# EAGLE design TeensyLED 15061000 (EAGLE 7.2.0)
DESCRIPTION: SaikoLED TeensyLED Breakout Board; DOCUMENT_NUMBER: 15041400; DRAWING_TITLE: TeensyLED; INFO: Brian Neltner, SaikoLED LLC, neltnerb@saikoled.com; REV: 15061000; VER: X3

## Sheet 1 of 4
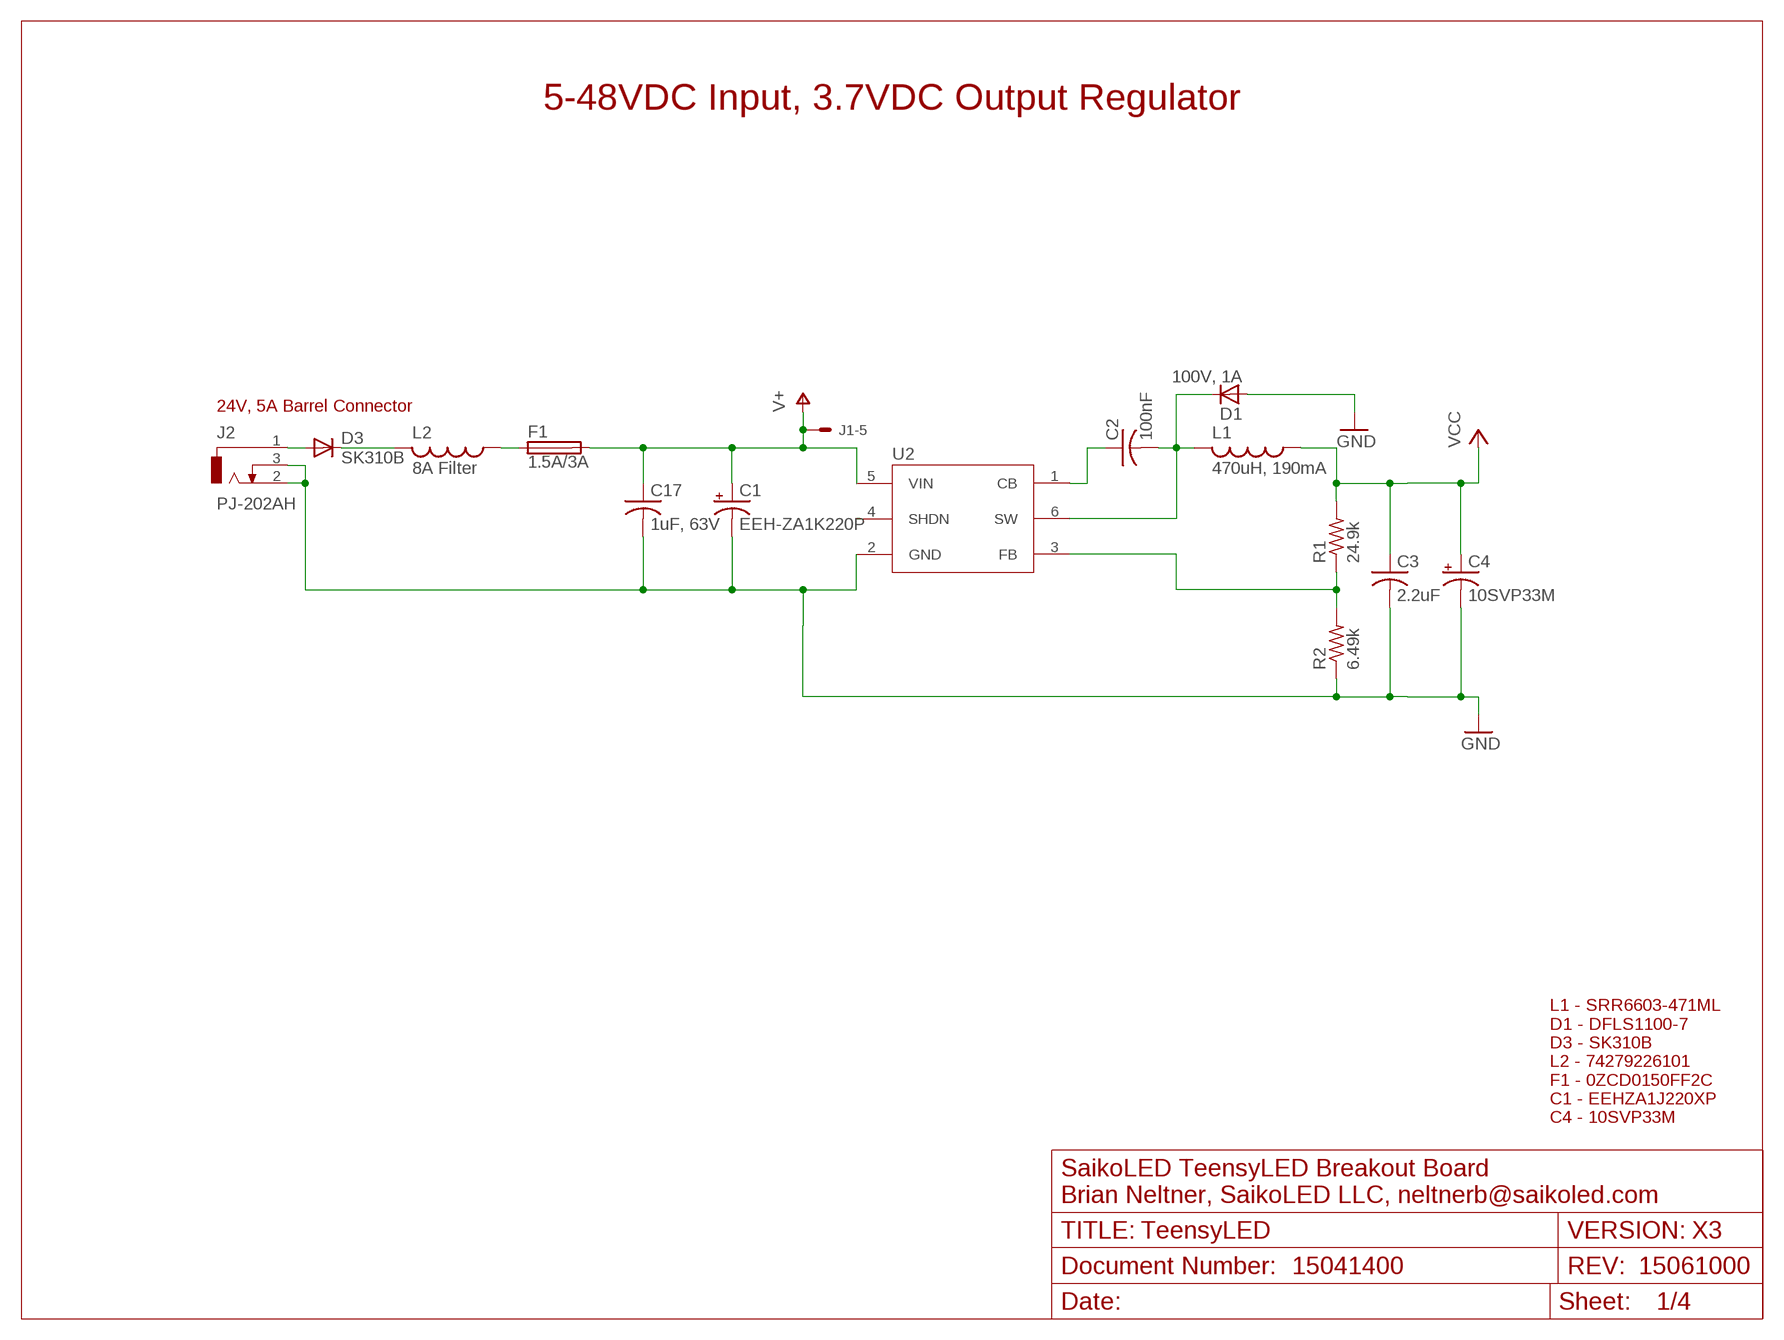
[diagram p0: schematic, sheet 1]

### Parts
C1  EEH-ZA1K220P  CPOL-USF  [PANASONIC_F]
C2  100nF  C-USC0805K  [C0805K]
C3  2.2uF  C-USC0402PRO  [C0402PRO]
C4  10SVP33M  CPOL-USB  [PANASONIC_B]
C17  1uF, 63V  C-USC0805K  [C0805K]
D1  100V, 1A  DFLS1100  [DFLS1100]
D3  SK310B  DIODE-SMB  [SMB]
F1  1.5A/3A  PTCFUSE-0ZCD  [2920]
FRAME1  LETTER_LNOSILK  [EMPTY]
J1  22-05-7058-05  [7395-05]
J2  PJ-202AH  [PJ-202AH]
L1  470uH, 190mA  L-US-SRR6603  [SRR6603]
L2  8A Filter  L-USL1812  [L1812]
R1  24.9k  R-US_R0402PRO  [R0402PRO]
R2  6.49k  R-US_R0402PRO  [R0402PRO]
U2  LMR16006YDDCT  [DDC0006A]

### Nets
GND: C1.- C3.2 C4.- C17.2 D1.A J2.2 J2.3 R2.1 U2.2(GND) ; also sheet 2,3,4
N$2: C2.1 U2.1(CB)
N$4: F1.P$1 L2.1
N$5: R1.1 R2.2 U2.3(FB)
N$9: D3.C L2.2
N$30: D3.A J2.1
V+: C1.+ C17.1 F1.P$2 J1.5 U2.5(VIN) ; also sheet 2
VCC: C3.1 C4.+ L1.P$1 R1.2 ; also sheet 3
VSW: C2.2 D1.C L1.P$2 U2.6(SW)
Unconnected: U2.4(SHDN)

### Notes on the sheet
- 5-48VDC Input, 3.7VDC Output Regulator
- 24V, 5A Barrel Connector
- L1 - SRR6603-471ML
  D1 - DFLS1100-7
  D3 - SK310B
  L2 - 74279226101
  F1 - 0ZCD0150FF2C
  C1 - EEHZA1J220XP
  C4 - 10SVP33M

## Sheet 2 of 4
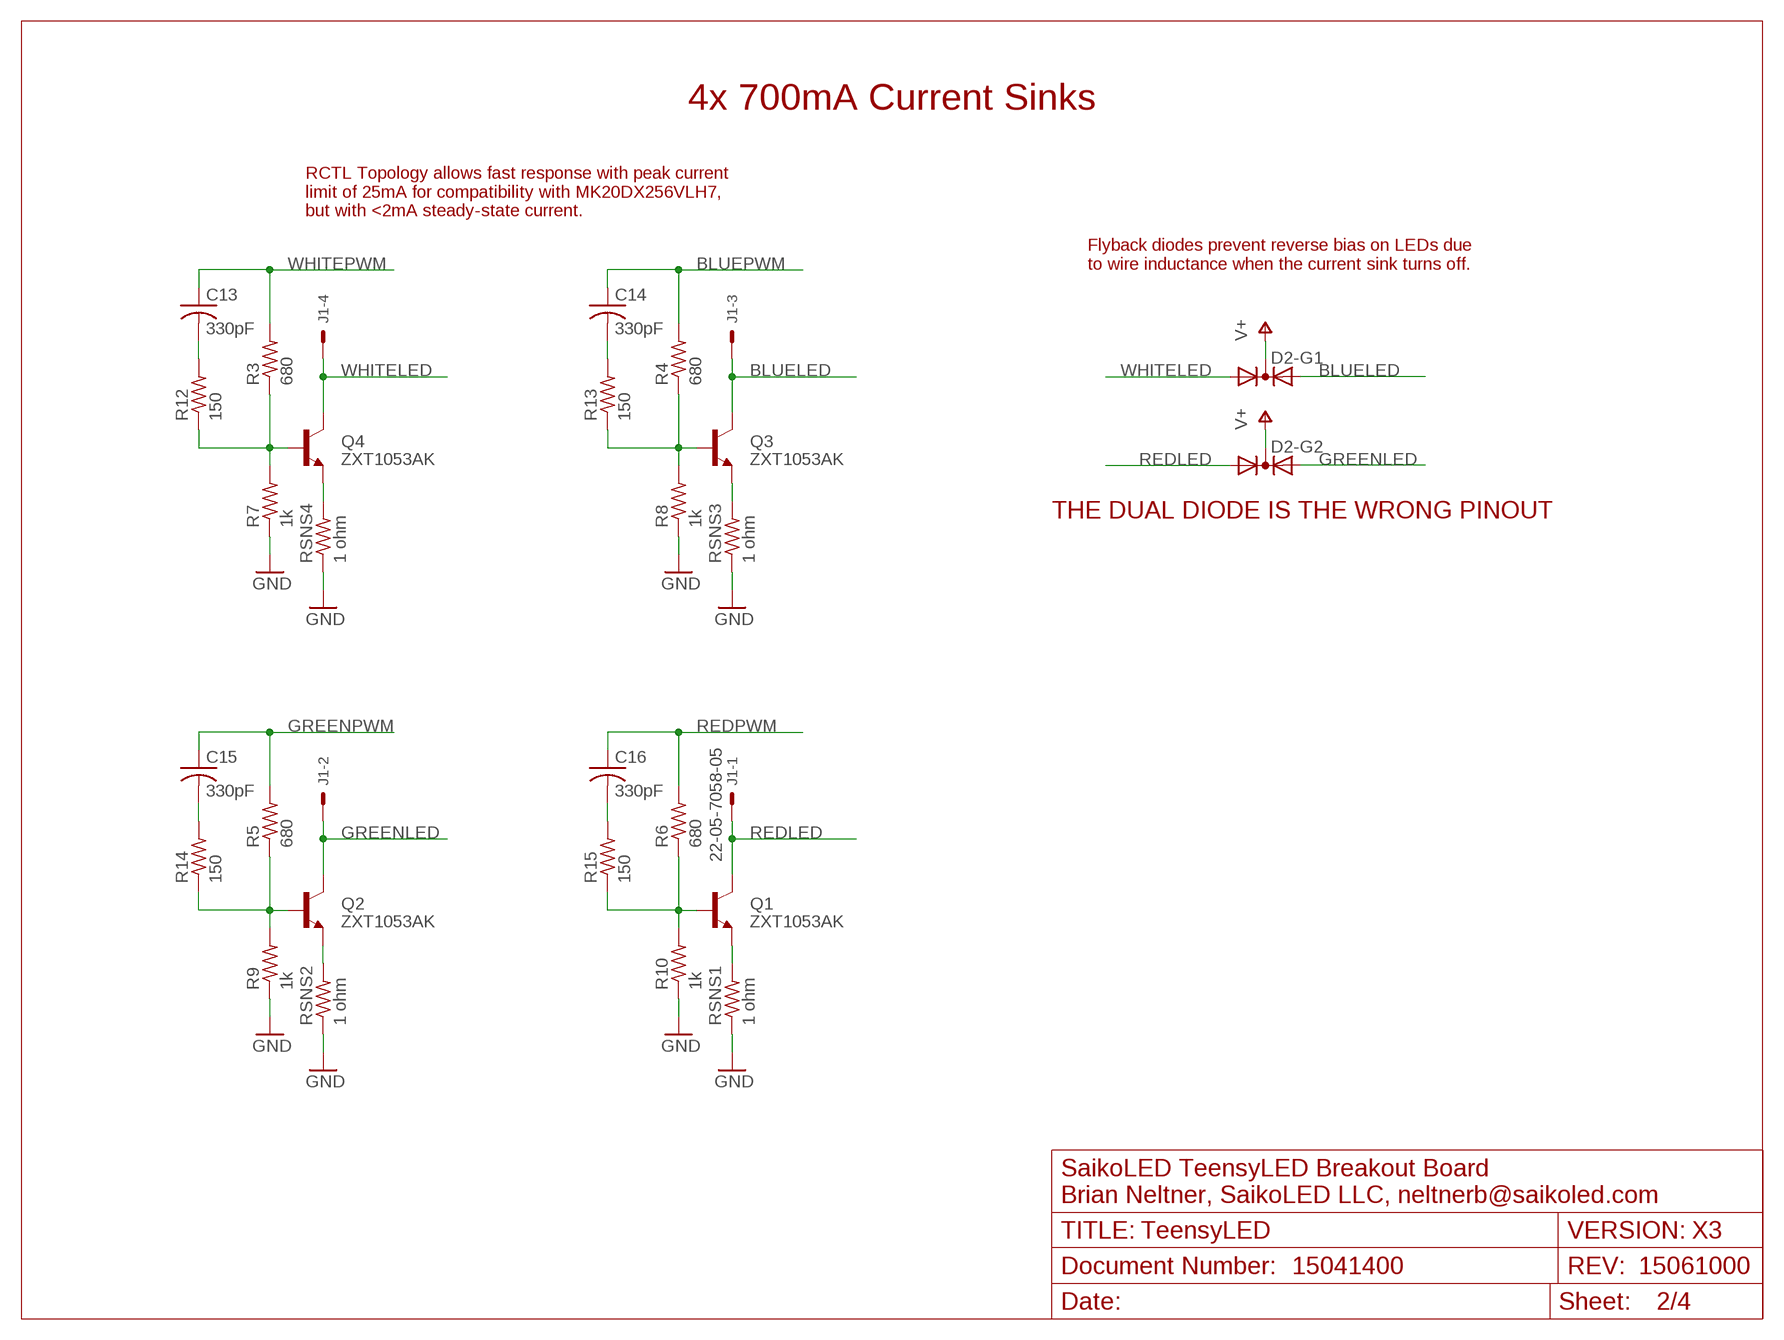
[diagram p1: schematic, sheet 2]

### Parts
C13  330pF  C-USC0402PRO  [C0402PRO]
C14  330pF  C-USC0402PRO  [C0402PRO]
C15  330pF  C-USC0402PRO  [C0402PRO]
C16  330pF  C-USC0402PRO  [C0402PRO]
D2  DUAL_DIODE_AC-CA-SOT363  [SOT363_PHILIPS]
FRAME2  LETTER_LNOSILK  [EMPTY]
Q1  ZXT1053AK  [TO252]
Q2  ZXT1053AK  [TO252]
Q3  ZXT1053AK  [TO252]
Q4  ZXT1053AK  [TO252]
R3  680  R-US_R0402PRO  [R0402PRO]
R4  680  R-US_R0402PRO  [R0402PRO]
R5  680  R-US_R0402PRO  [R0402PRO]
R6  680  R-US_R0402PRO  [R0402PRO]
R7  1k  R-US_R0402PRO  [R0402PRO]
R8  1k  R-US_R0402PRO  [R0402PRO]
R9  1k  R-US_R0402PRO  [R0402PRO]
R10  1k  R-US_R0402PRO  [R0402PRO]
R12  150  R-US_R0402PRO  [R0402PRO]
R13  150  R-US_R0402PRO  [R0402PRO]
R14  150  R-US_R0402PRO  [R0402PRO]
R15  150  R-US_R0402PRO  [R0402PRO]
RSNS1  1 ohm  R-US_R1206  [R1206]
RSNS2  1 ohm  R-US_R1206  [R1206]
RSNS3  1 ohm  R-US_R1206  [R1206]
RSNS4  1 ohm  R-US_R1206  [R1206]

### Nets
BLUELED: D2.3(-G1:A2) J1.3 Q3.C
BLUEPWM: C14.1 R4.2 ; also sheet 3
GND: R7.1 R8.1 R9.1 R10.1 RSNS1.1 RSNS2.1 RSNS3.1 RSNS4.1 ; also sheet 1,3,4
GREENLED: D2.4(-G2:A2) J1.2 Q2.C
GREENPWM: C15.1 R5.2 ; also sheet 3
N$8: Q2.E RSNS2.2
N$11: Q4.E RSNS4.2
N$12: Q3.E RSNS3.2
N$15: Q1.E RSNS1.2
N$16: Q2.B R5.1 R9.2 R14.1
N$20: Q4.B R3.1 R7.2 R12.1
N$22: Q1.B R6.1 R10.2 R15.1
N$26: C13.2 R12.2
N$27: C14.2 R13.2
N$28: C15.2 R14.2
N$29: C16.2 R15.2
R23: Q3.B R4.1 R8.2 R13.1
REDLED: D2.6(-G2:A1) J1.1 Q1.C
REDPWM: C16.1 R6.2 ; also sheet 3
V+: D2.2(-G1:K) D2.5(-G2:K) ; also sheet 1
WHITELED: D2.1(-G1:A1) J1.4 Q4.C
WHITEPWM: C13.1 R3.2 ; also sheet 3

### Notes on the sheet
- 4x 700mA Current Sinks
- RCTL Topology allows fast response with peak current
  limit of 25mA for compatibility with MK20DX256VLH7,
  but with <2mA steady-state current.
- Flyback diodes prevent reverse bias on LEDs due
  to wire inductance when the current sink turns off.
- THE DUAL DIODE IS THE WRONG PINOUT

## Sheet 3 of 4
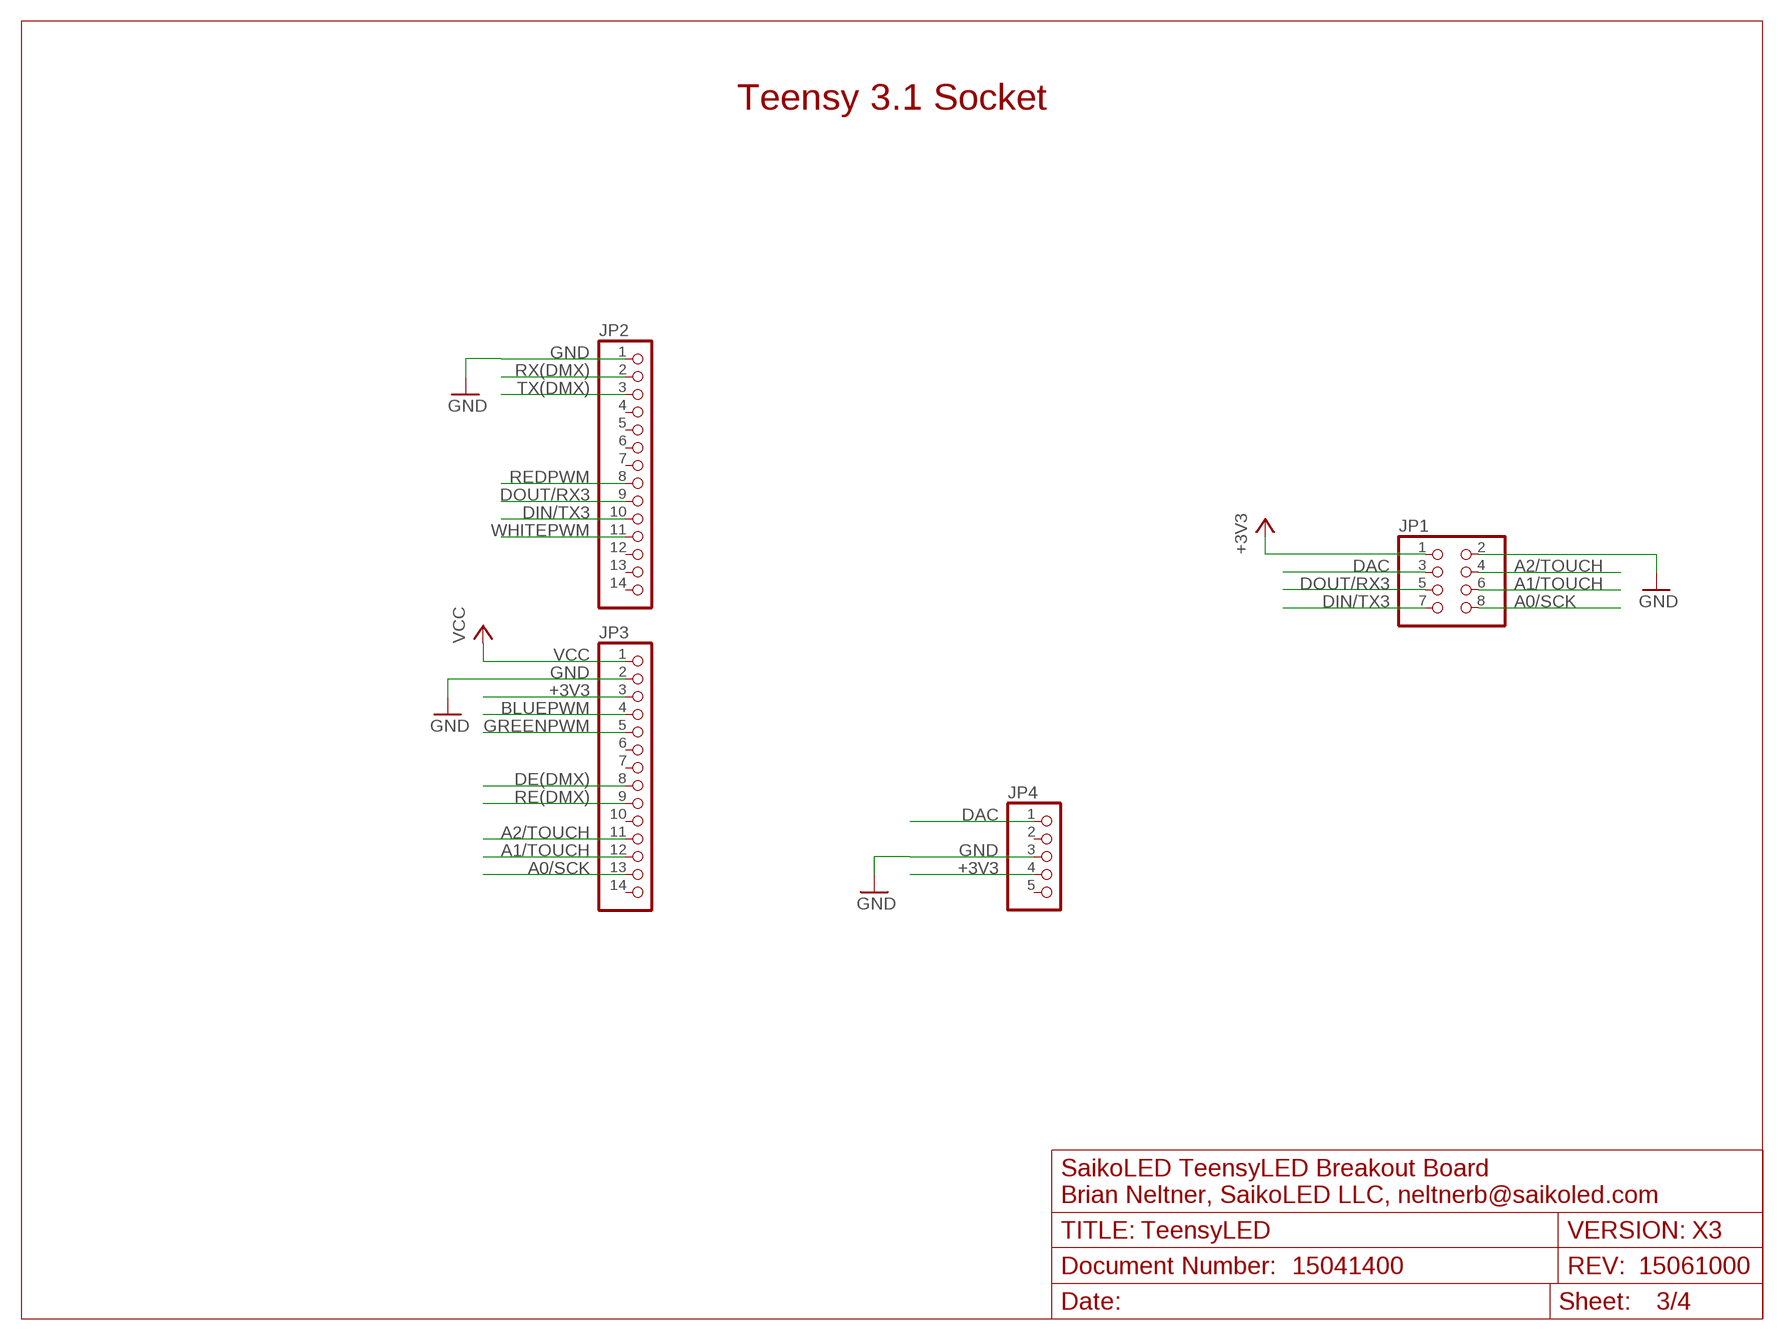
[diagram p2: schematic, sheet 3]

### Parts
FRAME3  LETTER_LNOSILK  [EMPTY]
JP1  PINHD-2X4  [2X04]
JP2  PINHD-1X14/ROUND  [1X14/ROUND]
JP3  PINHD-1X14/ROUND  [1X14/ROUND]
JP4  PINHD-1X5/ROUND  [1X05/ROUND]

### Nets
+3V3: JP1.1 JP3.3 JP4.4 ; also sheet 4
A0/SCK: JP1.8 JP3.13
A1/TOUCH: JP1.6 JP3.12
A2/TOUCH: JP1.4 JP3.11
BLUEPWM: JP3.4 ; also sheet 2
DAC: JP1.3 JP4.1
DE(DMX): JP3.8 ; also sheet 4
DIN/TX3: JP1.7 JP2.10
DOUT/RX3: JP1.5 JP2.9
GND: JP1.2 JP2.1 JP3.2 JP4.3 ; also sheet 1,2,4
GREENPWM: JP3.5 ; also sheet 2
RE(DMX): JP3.9 ; also sheet 4
REDPWM: JP2.8 ; also sheet 2
RX(DMX): JP2.2 ; also sheet 4
TX(DMX): JP2.3 ; also sheet 4
VCC: JP3.1 ; also sheet 1
WHITEPWM: JP2.11 ; also sheet 2
Unconnected: JP2.4 JP2.5 JP2.6 JP2.7 JP2.12 JP2.13 JP2.14 JP3.6 JP3.7 JP3.10 JP3.14 JP4.2 JP4.5

### Notes on the sheet
- Teensy 3.1 Socket

## Sheet 4 of 4
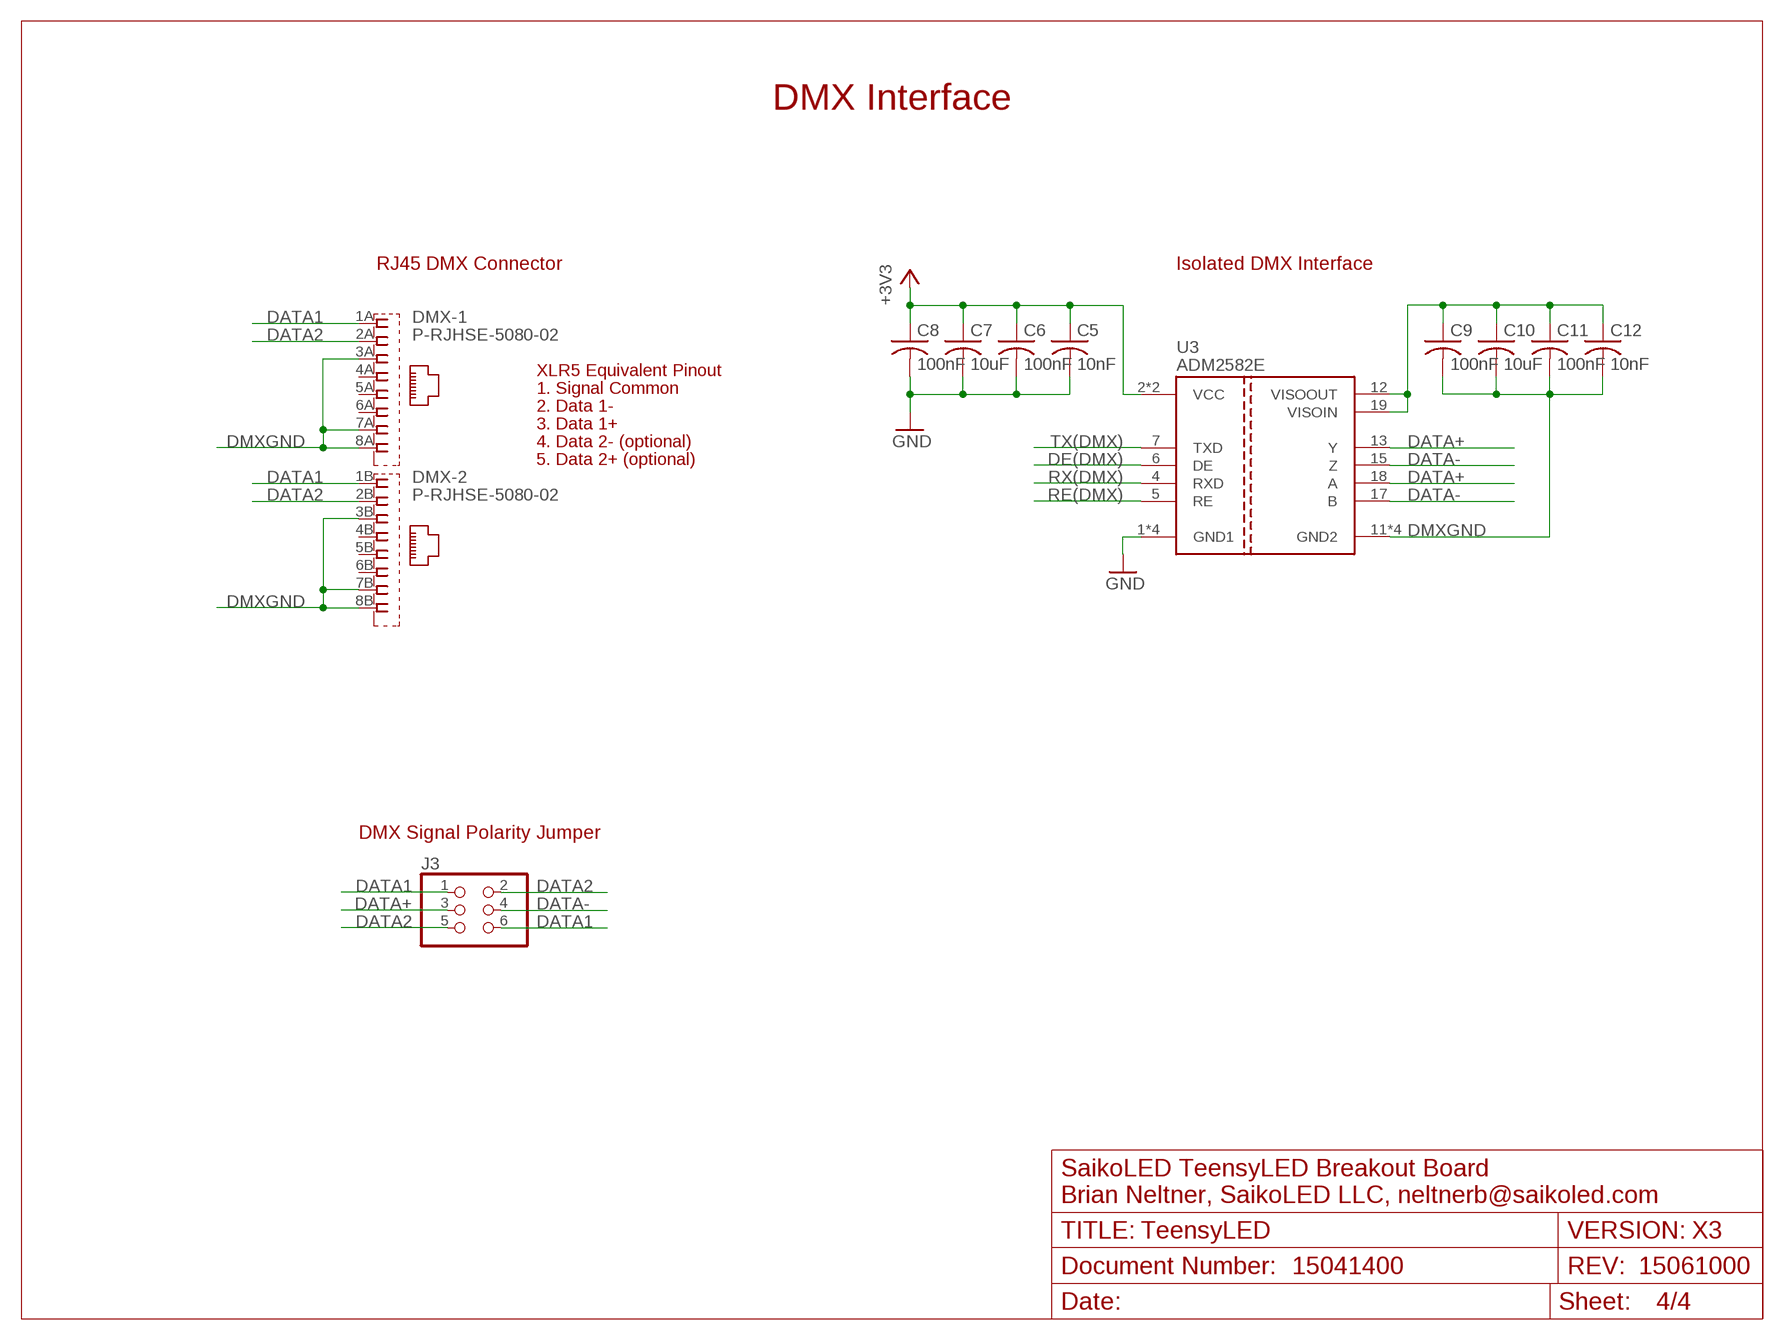
[diagram p3: schematic, sheet 4]

### Parts
C5  10nF  C-USC0402PRO  [C0402PRO]
C6  100nF  C-USC0402PRO  [C0402PRO]
C7  10uF  C-USC0402PRO  [C0402PRO]
C8  100nF  C-USC0402PRO  [C0402PRO]
C9  100nF  C-USC0402PRO  [C0402PRO]
C10  10uF  C-USC0402PRO  [C0402PRO]
C11  100nF  C-USC0402PRO  [C0402PRO]
C12  10nF  C-USC0402PRO  [C0402PRO]
DMX  P-RJHSE-5080-02  [P-RJHSE-5080-02]
FRAME4  LETTER_LNOSILK  [EMPTY]
J3  PINHD-2X3  [2X03]
U3  ADM2582E  [SO-20DW]

### Nets
+3V3: C5.1 C6.1 C7.1 C8.1 U3.2(VCC) U3.8(VCC) ; also sheet 3
DATA1: DMX.1A DMX.1B J3.1 J3.6
DATA2: DMX.2A DMX.2B J3.2 J3.5
DATA+: J3.3 U3.13(Y) U3.18(A)
DATA-: J3.4 U3.15(Z) U3.17(B)
DE(DMX): U3.6(DE) ; also sheet 3
DMXGND: C9.2 C10.2 C11.2 C12.2 DMX.3A DMX.3B DMX.7A DMX.7B DMX.8A DMX.8B U3.11(GND2) U3.14(GND2) U3.16(GND2) U3.20(GND2)
GND: C5.2 C6.2 C7.2 C8.2 U3.1(GND1) U3.3(GND1) U3.9(GND1) U3.10(GND1) ; also sheet 1,2,3
N$10: C9.1 C10.1 C11.1 C12.1 U3.12(VISOOUT) U3.19(VISOIN)
RE(DMX): U3.5(RE) ; also sheet 3
RX(DMX): U3.4(RXD) ; also sheet 3
TX(DMX): U3.7(TXD) ; also sheet 3
Unconnected: DMX.4A DMX.4B DMX.5A DMX.5B DMX.6A DMX.6B

### Notes on the sheet
- DMX Interface
- RJ45 DMX Connector | Isolated DMX Interface
- XLR5 Equivalent Pinout
- 1. Signal Common
- 2. Data 1-
- 3. Data 1+
- 4. Data 2- (optional)
- 5. Data 2+ (optional)
- DMX Signal Polarity Jumper

## Library data of the parts
C1 C4 = rcl:CPOL-US: POLARIZED CAPACITOR, American symbol
C2 = rcl:C-US: CAPACITOR, American symbol; OC_NEWARK: unknown
C3 C17 = rcl:C-US: CAPACITOR, American symbol; MF: Multicomp Passives; MPN: MCLV4R7M1HB-0513-RH; OC_NEWARK: 79K3674
C5-C16 = rcl:C-US: CAPACITOR, American symbol
D1 = 0_diodes:DFLS1100: Reference DIODE temperature compensated, 6,2 V
D2 = 0_diodes:DUAL_DIODE_AC-CA: DUAL DIODE
D3 = diode:DIODE-: DIODE
DMX = 0_amphenol:P-RJHSE-5080-02: Mod. Jack, Right Angle, 8 posiotion, 8 contatcs RJ45 Source: GLX-S-88M.pdf
F1 = 0_bel_fuse:PTCFUSE: LITTLEFUSE Picofuse/slow Littlefuse
FRAME1-FRAME4 = frames:LETTER_L: FRAME LETTER landscape
J1 = con-molex:22-?-05: CONNECTOR wire to board 2.54 mm (.1 inch) pitch header; OC_FARNELL: unknown; OC_NEWARK: unknown
J2 = 0_cui:PJ-202AH: DC POWER JACK Source: DCJ0202.pdf
J3 = pinhead:PINHD-2X3: PIN HEADER
JP1 = pinhead:PINHD-2X4: PIN HEADER
JP2 JP3 = pinhead:PINHD-1X14: PIN HEADER
JP4 = pinhead:PINHD-1X5: PIN HEADER
L1 = 0_coilcraft:L-US: INDUCTOR, American symbol
L2 = rcl:L-US: INDUCTOR, American symbol
Q1-Q4 = 0_diodes:ZXT1053AK: NPN Transistor ZXT1053AK DPAK TRANSISTOR 5A, 75V, hFE=300@1A, 4.4W
R1 = rcl:R-US_: RESISTOR, American symbol; MPN: BLU0402-9762-BT25W; OC_NEWARK: 32Y2244
R2 = rcl:R-US_: RESISTOR, American symbol; MPN: ERJ-3EKF4123V; OC_NEWARK: 53W4620
R3-R10 R12-R15 RSNS1-RSNS4 = rcl:R-US_: RESISTOR, American symbol
U2 = 0_texas_instruments:LMR16006YDDCT; COMPTYPE: IC; MANUFACTURER: Texas Instruments; MANUFACTURER_NAME: Texas Instruments; MANUFACTURER_PART_NUMBER: LMR16006YDDCT; MF: FARNELL; MOUNTTYPE: SMT; MPN: MCF 0.25W 1K; OC_NEWARK: 38K0327; PACKAGEREFERENCE: DDC0006A; PARTNUMBER: LMR16006YDDC; PIN_COUNT: 6; REFDES: RefDes; ROHS: Y; TYPE: TYPE; VALUE: Value
U3 = 0_analog_devices:ADM2582E

## Board
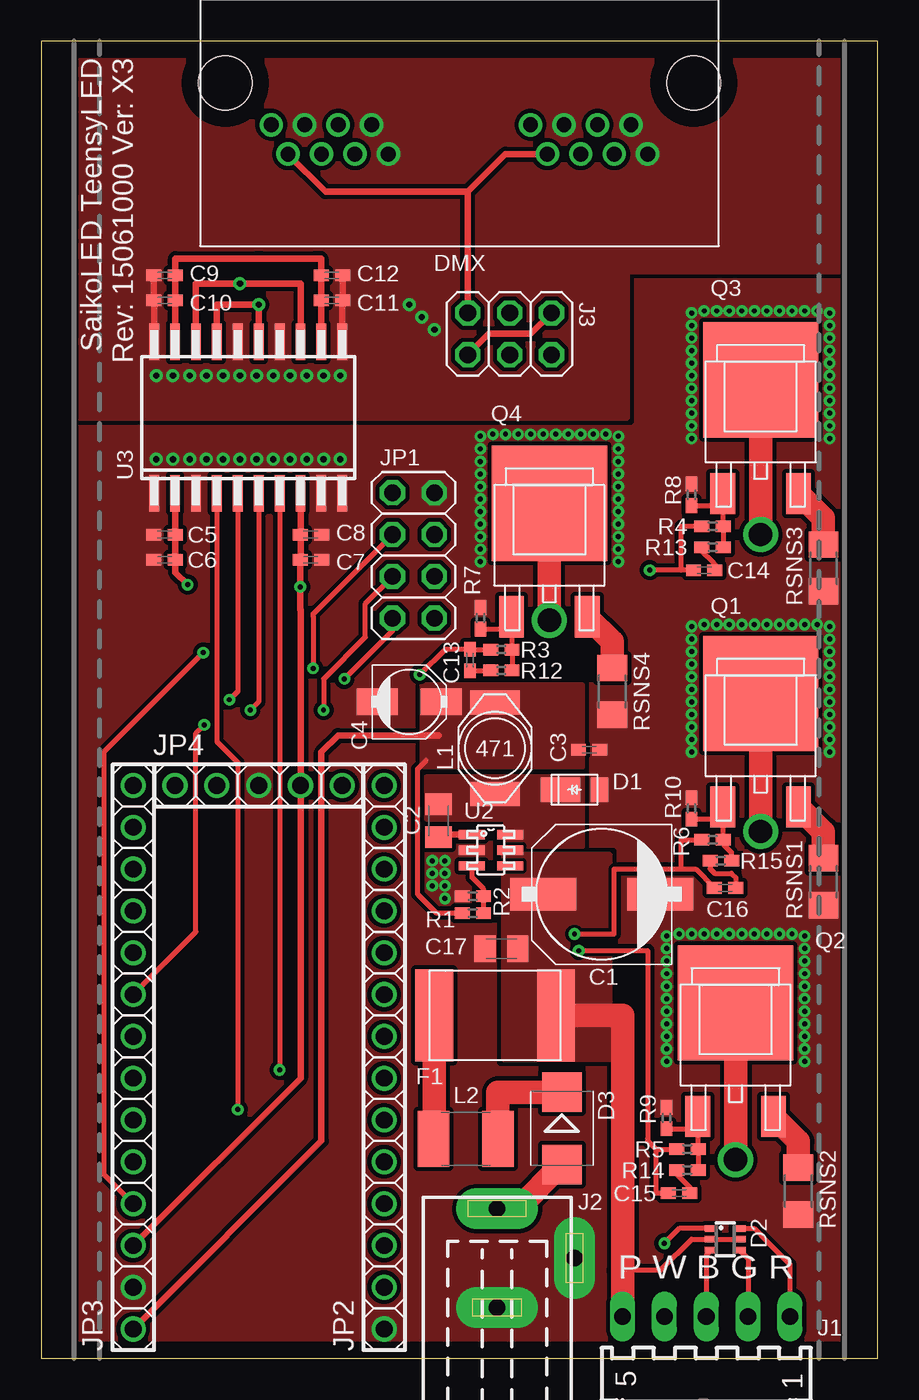
[diagram p4: board, top side]
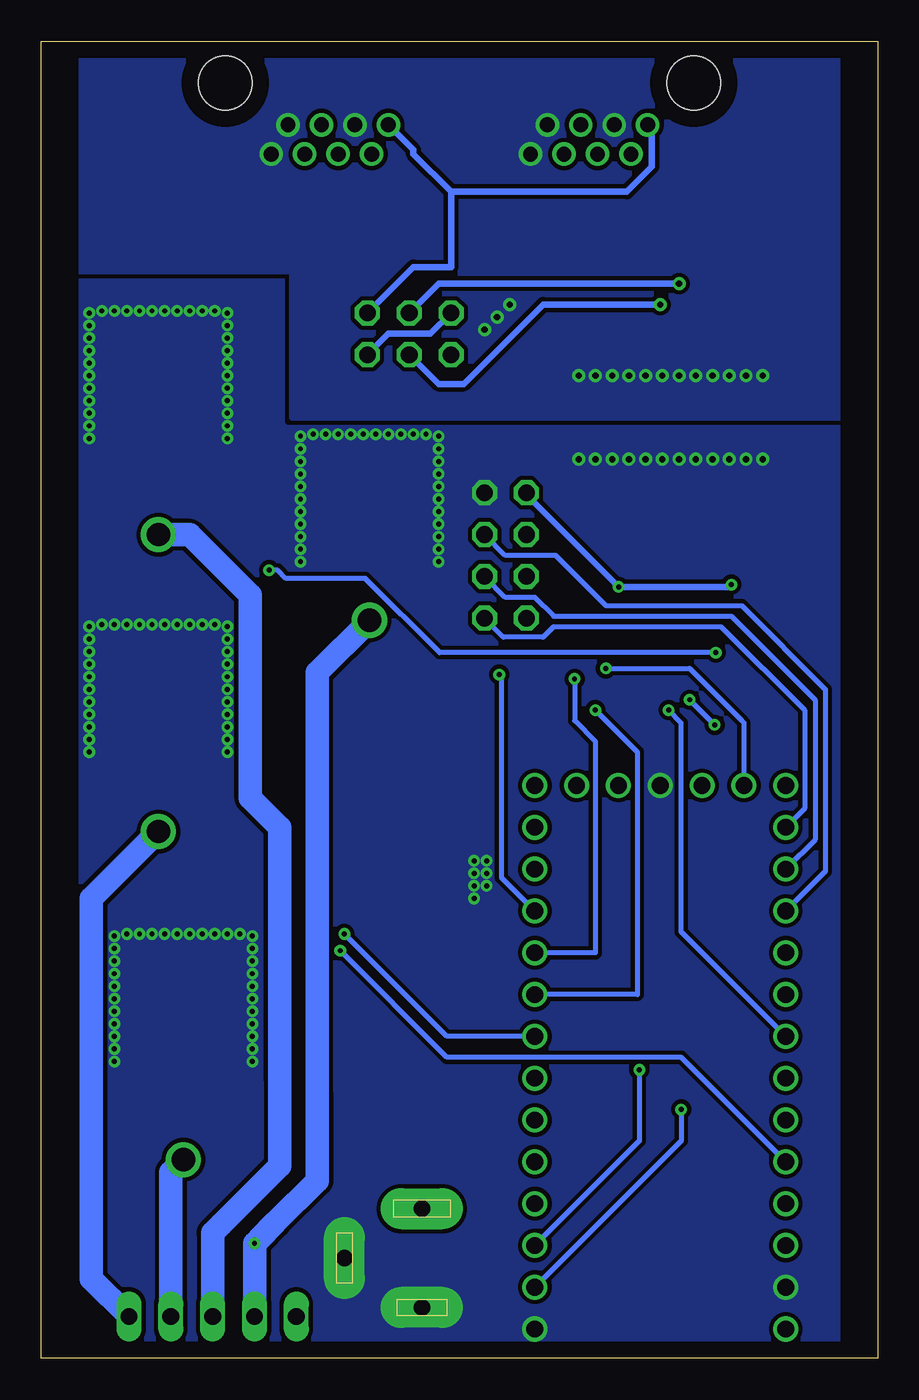
[diagram p5: board, bottom side, seen from below]

Size 50.8 x 80.01 mm. Coordinates in mm from the lower left corner, seen from the top.
Outline: 0,0 50.8,0 50.8,80.01 0,80.01 0,0
Copper layers (1*16): Top 0.035mm / dielectric 1.5mm / Bottom 0.035mm
Design rules "default *": minimum track width 12mil, minimum drill 0.3mm, track to track 8mil, track to pad 8mil, pad to pad 8mil, via to via 8mil, smd to smd 8mil, copper to edge 40mil, drill to drill 8mil, minimum pad ring 10mil, minimum via ring 8mil, stop-mask expansion 4mil, vias tented up to drill 0mil, thermal gap 10mil
tRestrict: area 0,0 to 2,80; area 48.8,0 to 50.8,80
bRestrict: area 0,0 to 2,80; area 48.8,0 to 50.8,80

### Footprints (pad centres in the part's own frame; a part is rotated, then mirrored left to right if it is on the bottom)
PANASONIC_F = smd 4 x 2: + 3.55,0; - -3.55,0
C0805K = smd 1.3 x 1.6: 1 -1,0; 2 1,0
C0402PRO = smd 0.9 x 0.7: 1 -0.65,0; 2 0.65,0
PANASONIC_B = smd 2.5 x 1.6: + 1.95,0; - -1.95,0
DFLS1100 = smd 1.05 x 1.5: A -1.525,0 | smd 2.4 x 1.5: C 0.85,0
SOT363_PHILIPS = smd 0.4 x 0.8: 1 -0.65,-0.85; 2 0,-0.85; 3 0.65,-0.85; 4 0.65,0.85; 5 0,0.85; 6 -0.65,0.85
SMB = smd 2.4 x 2.4: A 2.2,0; C -2.2,0
P-RJHSE-5080-02 = drill 0.9 pad 1.422: 1A 11.43,2.54; 1B -4.318,2.54; 2A 10.414,4.318; 2B -5.334,4.318; 3A 9.398,2.54; 3B -6.35,2.54; 4A 8.382,4.318; 4B -7.366,4.318; 5A 7.366,2.54; 5B -8.382,2.54; 6A 6.35,4.318; 6B -9.398,4.318; 7A 5.334,2.54; 7B -10.414,2.54; 8A 4.318,4.318; 8B -11.43,4.318 | hole 3.251: -14.224,0; 14.224,0
2920 = smd 2.3 x 5.6: P$1 -3.7,0; P$2 3.7,0
7395-05 = drill 1.016 long: 1 5.08,0; 2 2.54,0; 3 0,0; 4 -2.54,0; 5 -5.08,0
PJ-202AH = drill 1 pad 2.5 long: 1 0,3; 2 0,-3; 3 4.7,0
2X03 = drill 1.016 octagon: 1 -2.54,-1.27; 2 -2.54,1.27; 3 0,-1.27; 4 0,1.27; 5 2.54,-1.27; 6 2.54,1.27
2X04 = drill 1.016 octagon: 1 -3.81,-1.27; 2 -3.81,1.27; 3 -1.27,-1.27; 4 -1.27,1.27; 5 1.27,-1.27; 6 1.27,1.27; 7 3.81,-1.27; 8 3.81,1.27
1X14/ROUND = drill 1.016: 1 -16.51,0; 2 -13.97,0; 3 -11.43,0; 4 -8.89,0; 5 -6.35,0; 6 -3.81,0; 7 -1.27,0; 8 1.27,0; 9 3.81,0; 10 6.35,0; 11 8.89,0; 12 11.43,0; 13 13.97,0; 14 16.51,0
1X05/ROUND = drill 1.016: 1 -5.08,0; 2 -2.54,0; 3 0,0; 4 2.54,0; 5 5.08,0
SRR6603 = smd 1.45 x 3: P$1 -2.775,0; P$2 2.775,0
L1812 = smd 1.9 x 3.4: 1 -1.95,0; 2 1.95,0
TO252 = smd 1.5 x 2.5: B -2.3,-6.9; E 2.3,-6.9 | smd 7 x 7: C 0,0
R0402PRO = smd 0.9 x 0.7: 1 -0.65,0; 2 0.65,0
R1206 = smd 1.6 x 1.803: 1 -1.422,0; 2 1.422,0
DDC0006A = smd 1.575 x 0.559: 1 -1.168,0.95; 2 -1.168,0; 3 -1.168,-0.95; 4 1.168,-0.95; 5 1.168,0; 6 1.168,0.95
SO-20DW = smd 0.6 x 2.2: 1 -5.715,-4.6; 2 -4.445,-4.6; 3 -3.175,-4.6; 4 -1.905,-4.6; 5 -0.635,-4.6; 6 0.635,-4.6; 7 1.905,-4.6; 8 3.175,-4.6; 9 4.445,-4.6; 10 5.715,-4.6; 11 5.715,4.6; 12 4.445,4.6; 13 3.175,4.6; 14 1.905,4.6; 15 0.635,4.6; 16 -0.635,4.6; 17 -1.905,4.6; 18 -3.175,4.6; 19 -4.445,4.6; 20 -5.715,4.6

### Placement (x,y rotation side)
C1  34.04,28.19 180 top
C2  24.13,32.66 90 top
C3  33.27,36.96 0 top
C4  22.35,39.88 0 top
C5  7.49,50.04 180 top
C6  7.49,48.51 180 top
C7  16.38,48.51 0 top
C8  16.38,50.04 0 top
C9  7.49,65.79 180 top
C10  7.49,64.26 180 top
C11  17.65,64.26 0 top
C12  17.65,65.79 0 top
C13  26.04,42.42 270 top
C14  40.26,47.88 0 top
C15  38.73,10.03 0 top
C16  41.53,28.57 0 top
C17  27.94,24.89 180 top
D1  32.38,34.54 180 top
D2  41.53,7.24 270 top
D3  31.62,13.97 270 top
DMX  25.4,77.47 180 top
F1  27.56,20.83 0 top
FRAME1  0,0 0 top
FRAME2  0,0 0 top
FRAME3  0,0 0 top
FRAME4  0,0 0 top
J1  40.39,2.54 0 top
J2  27.69,6.1 0 top
J3  28.45,62.23 180 top
JP1  22.61,48.77 270 top
JP2  20.83,18.29 90 top
JP3  5.59,18.29 90 top
JP4  13.21,34.8 0 top
L1  27.56,37.06 270 top
L2  25.78,13.34 0 top
Q1  43.69,40.39 0 top
Q2  42.16,21.59 0 top
Q3  43.69,59.44 0 top
Q4  30.86,51.94 0 top
R1  26.21,27.05 180 top
R2  26.21,28.07 0 top
R3  27.94,43.05 180 top
R4  40.77,50.55 180 top
R5  39.24,12.7 180 top
R6  40.77,31.5 180 top
R7  26.67,44.96 270 top
R8  39.5,52.45 270 top
R9  37.97,14.61 270 top
R10  39.5,33.4 270 top
R12  27.94,41.78 180 top
R13  40.77,49.28 180 top
R14  39.24,11.43 180 top
R15  41.27,30.23 180 top
RSNS1  47.5,28.96 90 top
RSNS2  45.97,10.16 90 top
RSNS3  47.5,48.01 90 top
RSNS4  34.67,40.51 90 top
U2  27.3,30.86 0 top
U3  12.57,57.15 0 top

### Tracks (layer width: path | path; a pad name or v marks a point on that pad's centre or on a via)
+3V3  (via drill 0.3)
  Top 0.305: 8.13,48.58 C6.1 | 8.13,49.85 C5.1 8.13,50.16 | 8.13,52.39 U3.2 | 15.75,48.58 C7.1 | 15.75,49.85 C8.1 15.75,50.16 | 15.75,52.39 U3.8
  Top 0.406: 8.13,49.85 8.13,48.58 | 8.13,52.39 8.13,50.16 | 15.75,49.85 15.75,48.58 | 15.75,52.39 15.75,50.16 | C7.1 15.73,47.24 15.73,46.99 v15.73,46.86 15.73,45.48 15.75,45.47 JP4.4 15.75,17.02 JP3.3 | C5.1 8.14,47.74 v8.89,46.99
  Bottom 0.406: v8.89,46.99 9.02,46.86 v15.73,46.86 21.34,52.47 JP1.1
A0/SCK
  Bottom 0.305: JP1.8 22.73,43.81 20.32,43.81 19.68,44.45 9.53,44.45 4.45,39.37 4.45,33.4 JP3.13
A1/TOUCH
  Bottom 0.305: JP1.6 22.61,46.23 20.83,46.23 19.68,45.09 8.89,45.09 3.81,40.01 3.81,31.5 JP3.12
A2/TOUCH
  Bottom 0.305: JP1.4 22.61,48.77 19.56,48.77 16.51,45.72 8.26,45.72 3.17,40.64 3.17,29.59 JP3.11
BLUELED  (via drill 1.42)
  Top 0.305: D2.3 40.39,6.3 J1.3
  Top 1.422: v43.69,50.04 Q3.C
  Bottom 1.422: v43.69,50.04 41.78,50.04 38.1,46.35 38.1,44.45 38.1,34.04 36.32,32.26 36.32,17.02 36.32,11.68 39.88,8.13 40.39,7.62 J1.3
BLUEPWM  (via drill 0.3)
  Top 0.305: C14.1 38.86,47.88 | R4.2 38.86,50.55 38.86,47.94 38.89,47.94 38.86,47.88 | v9.84,42.86 4.45,37.47 3.81,36.83 3.81,36.58 3.81,11.18 JP3.4 | 38.86,47.88 v36.96,47.88
  Bottom 0.305: v9.84,42.86 26.61,42.86 31.11,47.37 35.94,47.37 36.45,47.88 v36.96,47.88
DAC  (via drill 0.3)
  Top 0.305: v16.51,41.91 16.51,45.09 16.51,45.21 JP1.3
  Bottom 0.305: v16.51,41.91 11.43,41.91 8.26,38.73 8.13,38.61 JP4.1
DATA1
  Top 0.406: J3.6 27.18,62.23 29.72,62.23 J3.1
  Bottom 0.406: J3.1 28.19,66.29 25.91,66.29 25.91,70.87 | 25.91,70.87 28.19,73.15 28.19,73.41 DMX.1B | DMX.1A 13.72,74.68 13.72,72.39 15.24,70.87 25.91,70.87
DATA2
  Top 0.406: J3.5 25.91,70.87 | 25.91,70.87 28.19,73.15 DMX.2B | 25.91,70.87 17.27,70.87 DMX.2A
  Bottom 0.406: J3.5 27.18,62.23 29.72,62.23 J3.2
DATA+  (via drill 0.38)
  Top 0.406: U3.18 9.4,65.28 v12.06,65.28 11.81,65.28 15.75,65.28 U3.13
  Bottom 0.406: v12.06,65.28 26.67,65.28 J3.3
DATA-  (via drill 0.38)
  Top 0.406: U3.17 10.67,64.01 13.08,64.01 v13.21,64.01 U3.15
  Bottom 0.406: J3.4 26.67,59.18 25.4,59.18 25.15,59.18 20.32,64.01 v13.21,64.01
DE(DMX)  (via drill 0.3)
  Top 0.305: U3.6 13.21,39.88 v12.7,39.37
  Bottom 0.305: JP3.8 11.94,25.91 11.94,38.61 v12.7,39.37
DIN/TX3  (via drill 0.3)
  Top 0.305: JP1.7 21.34,44.2 v18.41,41.27
  Bottom 0.305: v18.41,41.27 18.41,38.73 17.14,37.47 17.14,24.77 17.14,24.64 JP2.10
DMXGND  (via drill 0.38)
  Top 0.305: 14.48,61.91 U3.14 | 12.06,61.91 U3.16 12.06,61.75
  Top 0.406: U3.11 18.29,64.26 C11.2 C12.2 | C9.2 C10.2 6.86,64.26 U3.20
  other vias: 6.99,59.69 8,59.69 9.02,59.69 10.03,59.69 11.05,59.69 12.06,59.69 13.08,59.69 14.1,59.69 15.11,59.69 16.13,59.69 17.14,59.69 18.16,59.69 22.35,64.01 23.11,63.25 23.88,62.48
  pour Top (isolate 0.254, no thermals): 0,57.15 35.56,57.15 35.56,66.04 50.8,66.04 50.8,80.01 0,80.01
  pour Bottom (isolate 0.254, no thermals): 0,57.15 35.56,57.15 35.56,66.04 50.8,66.04 50.8,80.01 0,80.01
DOUT/RX3  (via drill 0.3)
  Top 0.305: v17.14,39.37 17.14,41.27 19.68,43.81 19.68,45.85 JP1.5
  Bottom 0.305: v17.14,39.37 14.61,36.83 14.61,22.23 14.61,22.1 JP2.9
GND  (via drill 0.3, 0.38)
  other vias: 18.16,54.61 17.14,54.61 16.13,54.61 15.11,54.61 14.1,54.61 13.08,54.61 12.06,54.61 11.05,54.61 10.03,54.61 9.02,54.61 8,54.61 6.99,54.61 26.67,48.39 26.67,49.15 26.67,49.91 26.67,50.67 26.67,51.44 26.67,52.2 26.67,52.96 26.67,53.72 26.67,54.48 26.67,55.24 27.43,56.13 28.19,56.13 28.96,56.13 29.72,56.13 30.48,56.13 31.24,56.13 32,56.13 32.77,56.13 33.53,56.13 34.29,56.13 35.05,48.39 35.05,49.15 35.05,49.91 35.05,50.67 35.05,51.44 35.05,52.2 35.05,52.96 35.05,53.72 35.05,54.48 35.05,55.24 26.67,56.01 35.05,56.01 39.5,36.83 39.5,37.59 39.5,38.35 39.5,39.12 39.5,39.88 39.5,40.64 39.5,41.4 39.5,42.16 39.5,42.93 39.5,43.69 40.26,44.58 41.02,44.58 41.78,44.58 42.55,44.58 43.31,44.58 44.07,44.58 44.83,44.58 45.59,44.58 46.35,44.58 47.12,44.58 47.88,36.83 47.88,37.59 47.88,38.35 47.88,39.12 47.88,39.88 47.88,40.64 47.88,42.16 47.88,42.93 47.88,43.69 39.5,44.45 47.88,44.45 37.97,18.03 37.97,18.8 37.97,19.56 37.97,20.32 37.97,21.08 37.97,21.84 37.97,22.61 37.97,23.37 37.97,24.13 37.97,24.89 38.73,25.78 39.5,25.78 40.26,25.78 41.02,25.78 41.78,25.78 42.55,25.78 43.31,25.78 44.07,25.78 44.83,25.78 45.59,25.78 46.35,18.03 46.35,18.8 46.35,19.56 46.35,20.32 46.35,21.08 46.35,21.84 46.35,22.61 46.35,23.37 46.35,24.13 46.35,24.89 37.97,25.65 46.35,25.65 39.5,55.88 39.5,56.64 39.5,57.4 39.5,58.17 39.5,58.93 39.5,59.69 39.5,60.45 39.5,61.21 39.5,61.98 39.5,62.74 40.26,63.63 41.02,63.63 41.78,63.63 42.55,63.63 43.31,63.63 44.07,63.63 44.83,63.63 45.59,63.63 46.35,63.63 47.12,63.63 47.88,55.88 47.88,56.64 47.88,57.4 47.88,58.17 47.88,58.93 47.88,59.69 47.88,60.45 47.88,61.21 47.88,61.98 47.88,62.74 39.5,63.5 47.88,63.5 24.51,29.46 24.51,28.7 24.51,27.94 23.75,28.7 23.75,29.46 23.75,30.23 24.51,30.23 47.88,41.4
  pour Top (isolate 0.254, rank 3, no thermals): 0,0 50.8,0 50.8,80.01 0,80.01
  pour Bottom (isolate 0.254, rank 3, no thermals): 0,0 50.8,0 50.8,80.01 0,80.01
GREENLED  (via drill 1.42)
  Top 0.305: D2.4 42.93,6.04 J1.2
  Top 1.422: Q2.C v42.16,12.06
  Bottom 1.422: v42.16,12.06 42.93,11.3 J1.2
GREENPWM  (via drill 0.3)
  Top 0.305: C15.1 37.34,10.03 37.34,12.7 | 37.34,12.7 37.47,12.7 R5.2 | v32.64,24.77 36.83,24.77 36.83,13.34 36.83,13.21 37.34,12.7
  Bottom 0.305: JP3.5 11.94,18.29 21.21,18.29 26.16,18.29 v32.64,24.77
N$2
  Top 0.406: U2.1 24.64,31.81 C2.1
N$4
  Top 1.422: L2.1 23.86,13.34 F1.P$1
N$5
  Top 0.305: R1.1 R2.2 26.86,28.51 26.16,29.21 26.16,29.89 U2.3
N$8
  Top 1.422: RSNS2.2 45.97,13.18 Q2.E
N$9
  Top 1.422: D3.C 27.73,16.17 L2.2
N$10
  Top 0.406: U3.12 17,61.75 C11.1 C12.1 17,66.8 16.64,66.8 13.08,66.8 | U3.19 8.13,64.26 C10.1 C9.1 8.14,66.8 13.08,66.8 | 13.34,66.8 13.08,66.8
N$11
  Top 1.422: RSNS4.2 34.67,43.53 Q4.E
N$12
  Top 1.422: RSNS3.2 47.5,51.03 Q3.E
N$15
  Top 1.422: RSNS1.2 47.5,31.98 Q1.E
N$16
  Top 0.305: R14.1 R5.1 39.86,12.73 39.86,13.95 | Q2.B 39.86,13.95 | R9.2 39.85,13.96 39.86,13.95
  Top 0.406: Q2.B 39.89,14.69
N$20
  Top 0.305: R7.2 27.83,44.31 arc90 Q4.B 28.56,43.08 arc90 R3.1 R12.1
N$22
  Top 0.305: Q1.B 41.39,32.69 | 41.39,32.69 41.39,31.5 R6.1 41.42,31.23 41.91,30.73 R15.1 | R10.2 41.33,32.75 41.39,32.69
N$26
  Top 0.305: C13.2 27.29,41.77 R12.2
N$27
  Top 0.305: R13.2 40.12,49.04 40.77,48.39 40.91,48.24 C14.2
N$28
  Top 0.305: R14.2 38.59,11.19 39.24,10.54 39.38,10.4 C15.2
N$29
  Top 0.305: R15.2 40.62,29.73 40.89,29.46 41.91,29.46 42.16,29.21 42.18,29.2 C16.2
N$30
  Top 1.422: J2.1 28.95,9.1 D3.A
R23
  Top 0.305: R8.2 40.65,51.8 Q3.B 41.39,50.58 R4.1 R13.1
RE(DMX)  (via drill 0.3)
  Top 0.305: v9.91,38.48 9.4,37.97 9.4,25.91 JP3.9 | U3.5 11.94,40.51 v11.43,40.01
  Bottom 0.305: v9.91,38.48 v11.43,40.01
REDLED  (via drill 1.42)
  Top 0.305: D2.6 43.29,7.89 44.07,7.11 45.47,5.71 J1.1
  Top 1.422: v43.69,32 Q1.C
  Bottom 1.422: v43.69,32 47.75,27.94 47.75,4.83 J1.1
REDPWM  (via drill 0.3)
  Top 0.305: 38.86,29.72 38.86,31.5 R6.2 | v32.38,25.78 34.8,25.78 34.8,29.72 38.86,29.72 | 38.86,29.72 39.74,29.72 C16.1
  Bottom 0.305: JP2.8 26.16,19.56 v32.38,25.78
RX(DMX)  (via drill 0.3)
  Top 0.305: U3.4 10.67,37.47 11.94,36.2 v11.94,15.11
  Bottom 0.305: v11.94,15.11 11.94,13.21 JP2.2
TX(DMX)  (via drill 0.3)
  Top 0.305: 14.45,52.55 U3.7 v14.48,17.53
  Bottom 0.305: v14.48,17.53 14.48,13.21 JP2.3
V+
  Top 0.305: D2.5 D2.2 39.5,7.24 37.59,5.33 35.31,5.33
  Top 1.422: F1.P$2 35.31,20.83 35.31,5.33 J1.5
  pour Top (no thermals): 28.07,30.61 28.07,18.16 34.54,18.16 34.54,30.61
VCC
  Top 0.305: 23.37,36.32 22.86,35.81 22.86,28.19 24,27.05 R1.2
  Top 0.406: JP3.1 17.02,13.21 17.02,36.83 18.03,37.85 24.13,37.85
  pour Top (no thermals): 32.89,35.94 32.89,40.89 23.11,40.89 23.11,35.94
VSW
  pour Top (no thermals): 32.89,31.11 32.89,35.31 23.37,35.31 23.37,32.77 28.19,32.77 28.19,31.11
WHITELED  (via drill 0.3, 1.42)
  Top 0.305: D2.1 38.75,7.89 v37.85,6.99
  Top 1.422: v30.86,44.83 Q4.C
  Bottom 0.305: v37.85,6.99 37.59,7.24
  Bottom 1.422: v30.86,44.83 34.04,41.66 34.04,16 34.04,10.79 36.58,8.26 37.59,7.24 v37.85,6.99 J1.4
WHITEPWM  (via drill 0.3)
  Top 0.305: R3.2 26.05,43.05 C13.1 24.53,43.07 v22.99,41.53
  Bottom 0.305: v22.99,41.53 22.86,41.4 22.86,29.46 22.86,29.21 JP2.11

### Text on the board
tPlace: SaikoLED TeensyLED / Rev: 15061000 Ver: X3 | P W B G R
Document: Dashed lines indicate area where parts / must be under 3.36mm in height.